# Altium schematic sheet TSC_XPT2046.SchDoc: TFT Touchscreen Interface
size A4; Organization: Altium Limited.; Address1: Level 3, 12a Rodborough Rd; Address2: Frenchs Forest 2086; Address3: NSW; Address4: AUSTRALIA; DocumentNumber: 31; SheetNumber: 32; SheetTotal: 78
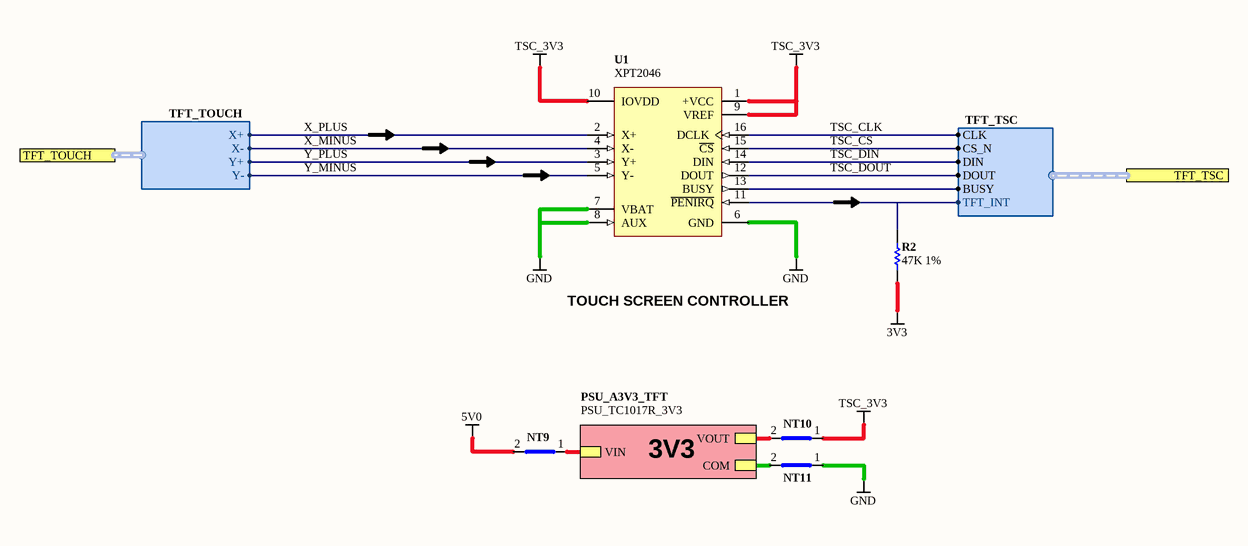
[diagram p0: TSC_XPT2046.SchDoc]

## Parts
NT9  Net Tie SMT2  [NETTIE-SMT2-31X51]  (value not drawn)  (net tie, no BOM)
NT10  Net Tie SMT2  [NETTIE-SMT2-31X51]  (value not drawn)  (net tie, no BOM)
NT11  Net Tie SMT2  [NETTIE-SMT2-31X51]  (value not drawn)  (net tie, no BOM)
R2  47K 1%  [RESC1005-STAR]
U1  XPT2046  [TSOP65P640-16AN]

## Sub-sheets
PSU_A3V3_TFT = PSU_TC1017R_3V3: VIN, VOUT, COM

## Ports
TFT_TOUCH (harness TFT_TOUCH), TFT_TSC (harness TFT_TSC)

## Harnesses
TFT_TSC: CLK, CS_N, DIN, DOUT, BUSY, TFT_INT
TFT_TOUCH: X+, X-, Y+, Y-

## Nets
3V3: R2.1
5V0: NT9.2(Net2)
GND: NT11.1(Net1) U1.6(GND) U1.7(VBAT) U1.8(AUX)
TSC_3V3: NT10.1(Net1) U1.1(+VCC) U1.9(VREF) U1.10(IOVDD)
TSC_CLK: U1.16(DCLK) ; port TFT_TSC.CLK
TSC_CS: U1.15(~{CS}) ; port TFT_TSC.CS_N
TSC_DIN: U1.14(DIN) ; port TFT_TSC.DIN
TSC_DOUT: U1.12(DOUT) ; port TFT_TSC.DOUT
X_MINUS: U1.4(X-) ; port TFT_TOUCH.X-
X_PLUS: U1.2(X+) ; port TFT_TOUCH.X+
Y_MINUS: U1.5(Y-) ; port TFT_TOUCH.Y-
Y_PLUS: U1.3(Y+) ; port TFT_TOUCH.Y+
NetNT9_1: NT9.1(Net1) ; sheet PSU_A3V3_TFT/VIN
NetNT10_2: NT10.2(Net2) ; sheet PSU_A3V3_TFT/VOUT
NetNT11_2: NT11.2(Net2) ; sheet PSU_A3V3_TFT/COM
NetR2_2: R2.2 U1.11(~{PENIRQ}) ; port TFT_TSC.TFT_INT
NetU1_13: U1.13(BUSY) ; port TFT_TSC.BUSY

## Notes on the sheet
- TOUCH SCREEN CONTROLLER
- 3V3
- Sheet Title
- Project Title
- Size:
- Date:
- A4
- Assy:
- Time:
- Revision:
- Sheet
- of
- File:

## Library data of the parts
NT9-NT11 = D-002-0003: Net-Tie, Surface Mount, 2 x 1.6mm x 0.8mm SMT Pads - For 0.8mm Track; Category: Net-Tie; Status: Production
R2 = D-100-0092: Resistor, 47K 1% 0402 (1005); Power Rating: 63 mW; Category: Resistor; Mounting Technology: Surface Mount; Resistance: 47 K; Status: Production; Tolerance: 1 %
U1 = D-202-0006: XPT2046, Touch Screen Controller; Supply Voltage: 2.7 to 5.5 V; Mounting Technology: Surface Mount; Status: Unreleased; Temperature Range: -40 to +85 degC; Category: IC-Video